# Altium project PrintNC_GRBLHAL_Breakout_QWIIC_CARD.PrjPCB
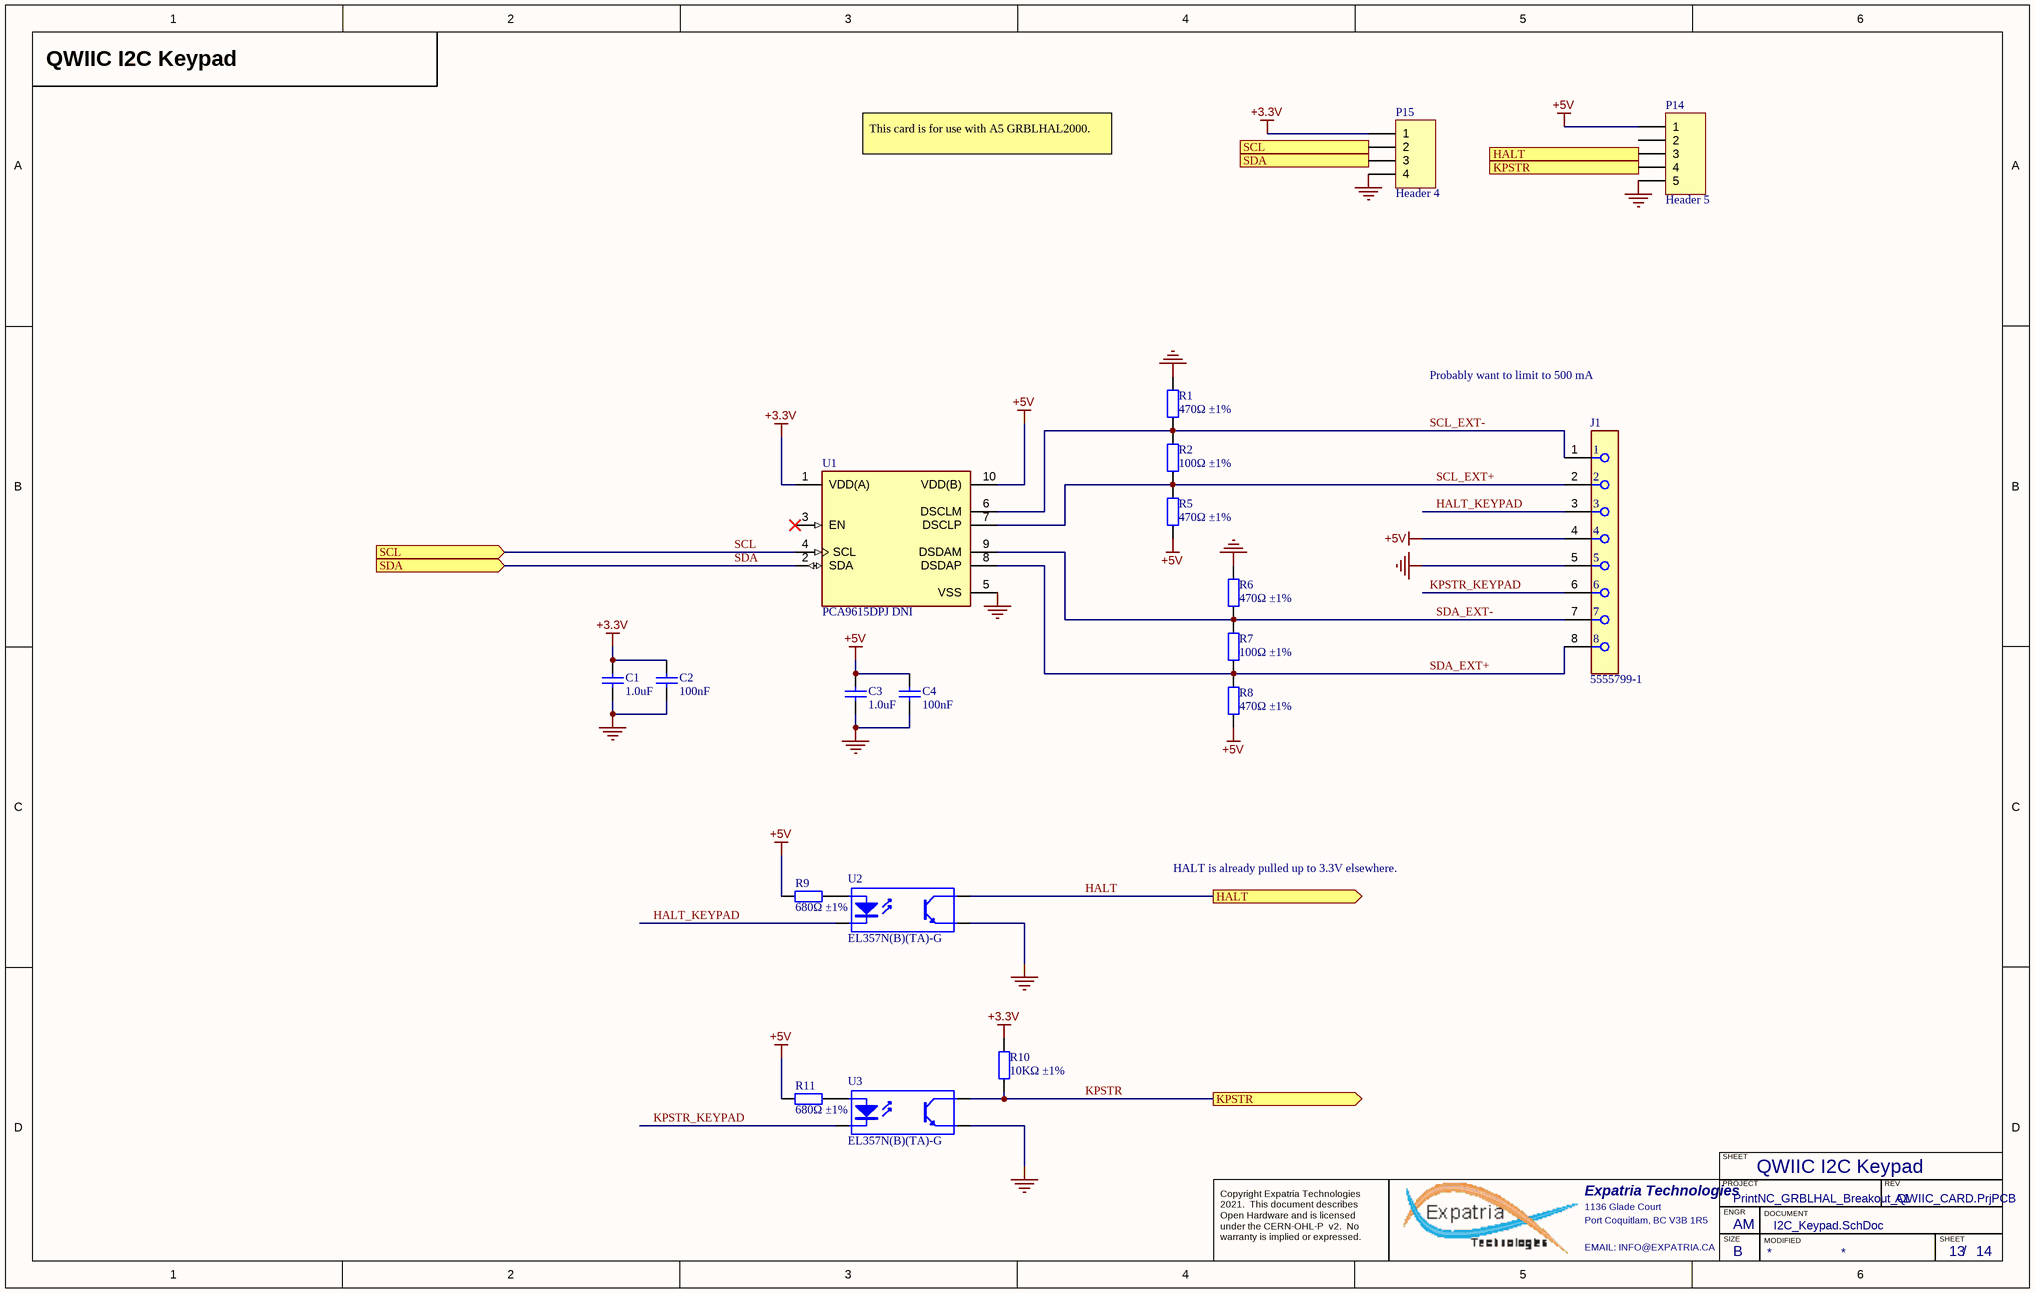
[diagram p0: I2C_Keypad.SchDoc]
PCBPARTNO: GRBLHAL_2000_BOB; PCBREVNO: A1; Title: GRBLHAL_2000_BOB; VarRevNo: A1
1 sheet, 19 parts. Net scope: hierarchical (ports join the sheet entries above them; power ports are global).
Board file: PrintNC_GRBLHAL_Breakout_QWIIC_CARD.pcbdoc

## Sheet I2C_Keypad.SchDoc: GRBLHAL_2000_BOB
size B; Author: AM; CompanyName: Expatria Technologies; DrawnBy: A.Marles; Engineer: AM; Organization: Expatria Technologies; DocumentNumber: 13; Revision: A1; SheetNumber: 13; SheetTotal: 14; PCB_Rev: A1

### Parts
C1  1.0uF  [0402_C]
C2  100nF  [0402_C]
C3  1.0uF  [0402_C]
C4  100nF  [0402_C]
J1  5555799-1  [FP-5555799-1-MFG]
P14  Header 5  [HDR1X5]
P15  Header 4  [HDR1X4]
R1  470Ω ±1%  [0402_R]
R2  100Ω ±1%  [0402_R]
R5  470Ω ±1%  [0402_R]
R6  470Ω ±1%  [0402_R]
R7  100Ω ±1%  [0402_R]
R8  470Ω ±1%  [0402_R]
R9  680Ω ±1%  [0402_R]
R10  10KΩ ±1%  [0402_R]
R11  680Ω ±1%  [0402_R]
U1  PCA9615DPJ DNI  [FP-SOT552-1-IPC_C]
U2  EL357N(B)(TA)-G  [SOP-4_P2.54]
U3  EL357N(B)(TA)-G  [SOP-4_P2.54]

### Ports
HALT (out), KPSTR (out), SCL (in), SDA (in)

### Nets
+3.3V: C1.2 C2.2 P15.1 R10.2 U1.1(VDD(A))
+5V: C3.2 C4.2 J1.4 P14.1 R5.1 R8.1 R9.1 R11.1 U1.10(VDD(B))
GND: C1.1 C2.1 C3.1 C4.1 J1.5 P14.5 P15.4 R1.2 R6.2 U1.5(VSS) U2.3(E) U3.3(E)
HALT: P14.3 U2.4(C) ; port HALT
HALT_KEYPAD: J1.3 U2.2(K)
KPSTR: P14.4 R10.1 U3.4(C) ; port KPSTR
KPSTR_KEYPAD: J1.6 U3.2(K)
SCL: P15.2 U1.4(SCL) ; port SCL
SCL_EXT+: J1.2 R2.1 R5.2 U1.7(DSCLP)
SCL_EXT-: J1.1 R1.1 R2.2 U1.6(DSCLM)
SDA: P15.3 U1.2(SDA) ; port SDA
SDA_EXT+: J1.8 R7.1 R8.2 U1.8(DSDAP)
SDA_EXT-: J1.7 R6.1 R7.2 U1.9(DSDAM)
NetR9_2: R9.2 U2.1(A)
NetR11_2: R11.2 U3.1(A)

Not connected (* = marked no-connect by the designer): P14 2; U1 3(EN)*

### Notes on the sheet
- QWIIC I2C Keypad
- This card is for use with A5 GRBLHAL2000.
- Probably want to limit to 500 mA
- HALT is already pulled up to 3.3V elsewhere.
- SHEET
- Expatria Technologies
- 1136 Glade Court
- Port Coquitlam, BC V3B 1R5
- PROJECT
- SIZE
- ENGR
- MODIFIED
- DOCUMENT
- REV
- Copyright Expatria Technologies 2021.  This document describes Open Hardware and is licensed under the CERN-OHL-P  v2.  No warranty is implied or expressed.
- EMAIL: INFO@EXPATRIA.CA
- B
- /

### Library data of the parts
C1 C3 = 0402 1.0uF (105) 10% 25V: Chip capacitor; Manufacturer: Samsung Electro-Mechanics; PartNumber: CL05A105KA5NQNC; Capacitance: 1uF; Tolerance: 10%; Voltage: 25V; ComponentLink1Description: Supplier link; ComponentLink1URL: http://www.szlcsc.com/product/details_53938.html; Package: 0402; Supplier: LC; SuppliersPartNumber: C52923
C2 C4 = 0402 100nF (104) 10% 16V: Chip capacitors; Manufacturer: Samsung Electro-Mechanics; PartNumber: CL05B104KO5NNNC; Tolerance: 10%; Voltage: 16V; ComponentLink1Description: Supplier link; ComponentLink1URL: http://www.szlcsc.com/product/details_1877.html; Package: 0402; Supplier: LC; SuppliersPartNumber: C1525; Capacitance: 100nF
J1 = CMP-03371-000003-1: CONN MOD JACK 8P8C VERT UNSHLD; Manufacturer: TE Connectivity; Pitch: 2.54mm; Number Of Contacts: 8; Is Female: yes; Device Class L3: unset; Manufacturer Part Number: 5555799-1; Temperature Range High: +85°C; Temperature Range Low: -40°C; Octopart: https://octopart.com/5555799-1-te+connectivity-39526335; Device Class L1: Connectors; Device Class L2: Modular / Ethernet Connectors; Mouser Description: Conn RJ-45 F 8 POS 2.54mm Solder ST Thru-Hole 8 Terminal 1 Port Cat 3 Box/Package/Tray; Digikey Description: CONN MOD JACK 8P8C VERT UNSHLD; Package: 5555799-1; Temperature: -40°C to +85°C; SuppliersPartNumber: C305983
P14 = Header 5: Header, 5-Pin; LatestRevisionDate: 17-Jul-2002; LatestRevisionNote: Re-released for DXP Platform.; Publisher: Altium Limited; SuppliersPartNumber: C124379
P15 = Header 4: Header, 4-Pin; Publisher: Altium Limited; SuppliersPartNumber: C124378
R1 R5 R6 R8 = 0402 470R (4700) 1%: Chip resistor; Manufacturer: Uniroyal Elec; PartNumber: 0402WGF4700TCE; Power: 1/16W; ComponentLink1Description: Supplier link; ComponentLink1URL: http://www.szlcsc.com/product/details_25860.html; Package: 0402; Supplier: LC; SuppliersPartNumber: C25117; Resistance: 470Ω; Tolerance: 1%
R2 R7 = 0402 100R (1000) 1%: Chip resistor; Manufacturer: Uniroyal Elec; PartNumber: 0402WGF1000TCE; Power: 1/16W; ComponentLink1Description: Supplier link; ComponentLink1URL: http://www.szlcsc.com/product/details_25819.html; Package: 0402; Supplier: LC; SuppliersPartNumber: C25076; Resistance: 100Ω; Tolerance: 1%
R9 R11 = 0402 680R (6800) 1%: Chip resistor; Manufacturer: Uniroyal Elec; PartNumber: 0402WGF6800TCE; Power: 1/16W; ComponentLink1Description: Supplier link; ComponentLink1URL: http://www.szlcsc.com/product/details_25873.html; Package: 0402; Supplier: LC; SuppliersPartNumber: C25130; Resistance: 680Ω; Tolerance: 1%
R10 = 0402 10K (1002) 1%: Chip resistor; Manufacturer: Uniroyal Elec; PartNumber: 0402WGF1002TCE; Power: 1/16W; ComponentLink1Description: Supplier link; ComponentLink1URL: http://www.szlcsc.com/product/details_26487.html; Package: 0402; Supplier: LC; SuppliersPartNumber: C25744; Resistance: 10KΩ; Tolerance: 1%
U1 = CMP-2000-06881-2: IC REDRIVER I2C 2CH 10TSSOP; Manufacturer: NXP; Max Junction Temp: +125°C; Standoff Height: 0.05mm; Sigbufrep Type: Buffer,ReDriver; Interface: I2C,SMBus; Input Capacitance: 7pF; Octopart: https://octopart.com/pca9615dpj-nxp+semiconductors-34972203; Device Class L1: Integrated Circuits (ICs); Package: SOT552-1; Ambient Temperature Range High: +85°C; Ambient Temperature Range Low: -40°C; Mouser Description: Interface - Signal Buffers, Repeaters 2-channel multipoint Differential I2C-bus; Digikey Description: IC REDRIVER I2C 2CH 10TSSOP; Device Class L3: Signal Buffers; Temperature: -40°C to +85°C; Ipc Land Pattern Name: SOP50P490X110-10; Manufacturer Part Number: PCA9615DPJ; Footprint Url: https://www.nxp.com/docs/en/package-information/SOT552-1.pdf; Temperature Range Low: -40°C; Device Class L2: Interface ICs; Temperature Range High: +85°C; SuppliersPartNumber: C2652385
U2 U3 = EL357N(B)(TA)-G_[C6649]: 贴片光耦; ComponentLink1Description: 供应商链接; ComponentLink1URL: http://www.szlcsc.com/product/details_7114.html; Package: SOP-4_P2.54; Supplier: LC; SuppliersPartNumber: C6649

## Assembly variants
SMT_ONLY: not fitted A1 J1 J1 J2 J3 J4 J5 J6 J7 J8 J9 J10 J11 J12 J13 J14 J15 J16 J22 J23 L3 P1 P2 P3 P4 P5 P6 P7 P8 P9 P10 P11 P12 P12 P13 P13 P14 P14 P15 P15 P16 P16 P17 P18 P18 P19 P19 R76 U15 VR2
FULL_ASSEMBLY: not fitted U15